# Altium schematic sheet I2C_HEADER.SchDoc: My title
size A3; Organization: University of California; Address1: 475 Portola Plaza; Address2: Los Angeles, CA 90095; DocumentNumber: 31; Revision: R01; SheetNumber: 31; SheetTotal: 35
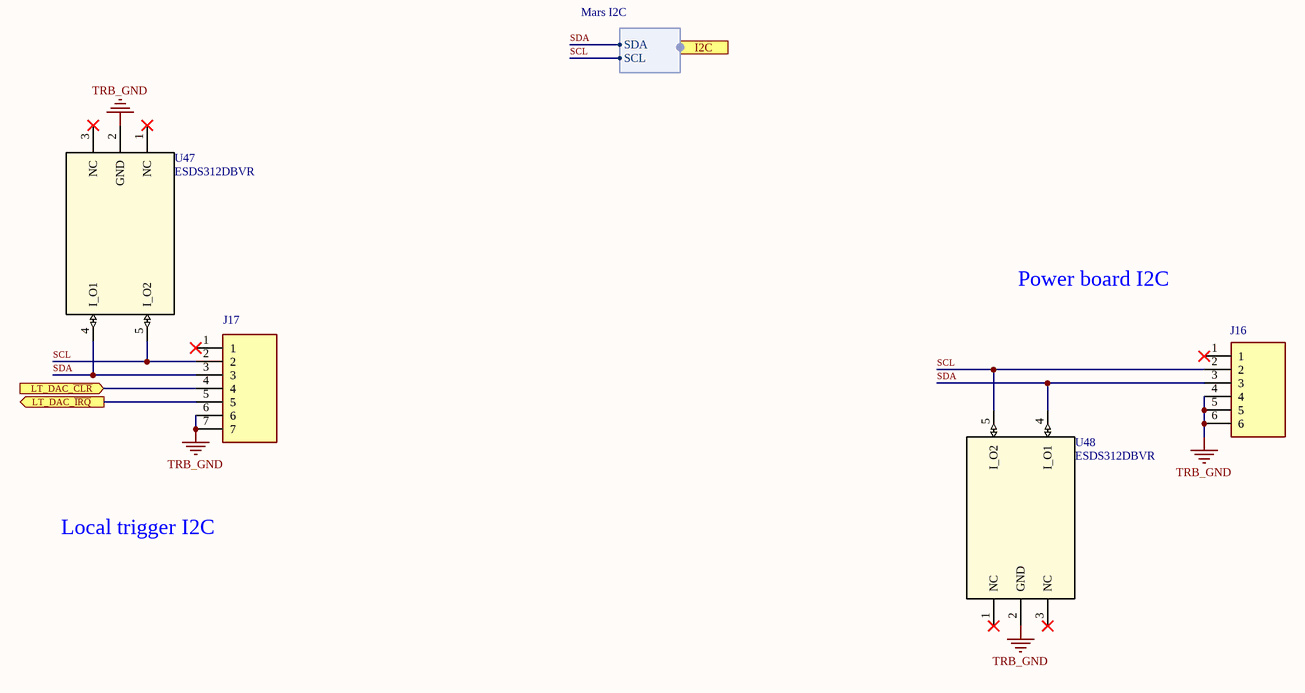
[diagram p0: I2C_HEADER.SchDoc]

## Parts
J16  61300611121  [HDRV6W64P0X254_1X6_1524X254X869P]  (value not drawn)
J17  61300711121  [HDRV7W64P0X254_1X7_1778X254X869P]  (value not drawn)
U47  ESDS312DBVR  [DBV0005A_L]
U48  ESDS312DBVR  [DBV0005A_L]

## Ports
I2C (harness Mars I2C), LT_DAC_~{CLR} (in), LT_DAC_~{IRQ} (out)

## Harnesses
Mars I2C: SCL, SDA

## Nets
TRB_GND: J16.4 J16.5 J16.6 J17.6 J17.7 U47.2(GND) U48.2(GND)
LT_DAC_~{CLR}: J17.4 ; port LT_DAC_~{CLR}
LT_DAC_~{IRQ}: J17.5 ; port LT_DAC_~{IRQ}
SCL: J16.2 J17.2 U47.5(I_O2) U48.5(I_O2) ; port I2C.SCL
SDA: J16.3 J17.3 U47.4(I_O1) U48.4(I_O1) ; port I2C.SDA

Not connected (* = marked no-connect by the designer): J16 1*; J17 1*; U47 1(NC)* 3(NC)*; U48 1(NC)* 3(NC)*

## Notes on the sheet
- Power board I2C
- Local trigger I2C
- 475 Portola Plaza
- GAPS TOF
- igarcia91@g.ucla.edu
- Los Angeles, CA
- 310-825-0344
- Size:
- Date:
- Letter
- Revision:
- Time:
- Sheet
- of
- andrew.peck@cern.ch
- spq@ucla.edu
- File:

## Library data of the parts
J16 = 61300611121: Connector; Manufacturer_Name: Wurth Elektronik; Datasheet Link: https://componentsearchengine.com//61300611121.pdf; Height: 8.69mm; Mouser2 Part Number: 710-61300611121; Mouser2 Price/Stock: https://www.mouser.com/Search/Refine.aspx?Keyword=710-61300611121; Manufacturer_Part_Number: 61300611121
J17 = 61300711121: Connector; Manufacturer_Name: Wurth Elektronik; Datasheet Link: https://componentsearchengine.com//61300711121.pdf; Height: 8.69mm; Mouser2 Part Number: 710-61300711121; Mouser2 Price/Stock: https://www.mouser.com/Search/Refine.aspx?Keyword=710-61300711121; Manufacturer_Part_Number: 61300711121
U47 U48 = ESDS312DBVR: 3.6V Data-Line Surge and 30kV ESD Protection Diode; Manufacturer: Texas Instruments; PartNumber: ESDS312DBVR; RefDes: RefDes; Type: DEV; Value: Value